# EAGLE design schm1 (EAGLE 7.6.0)
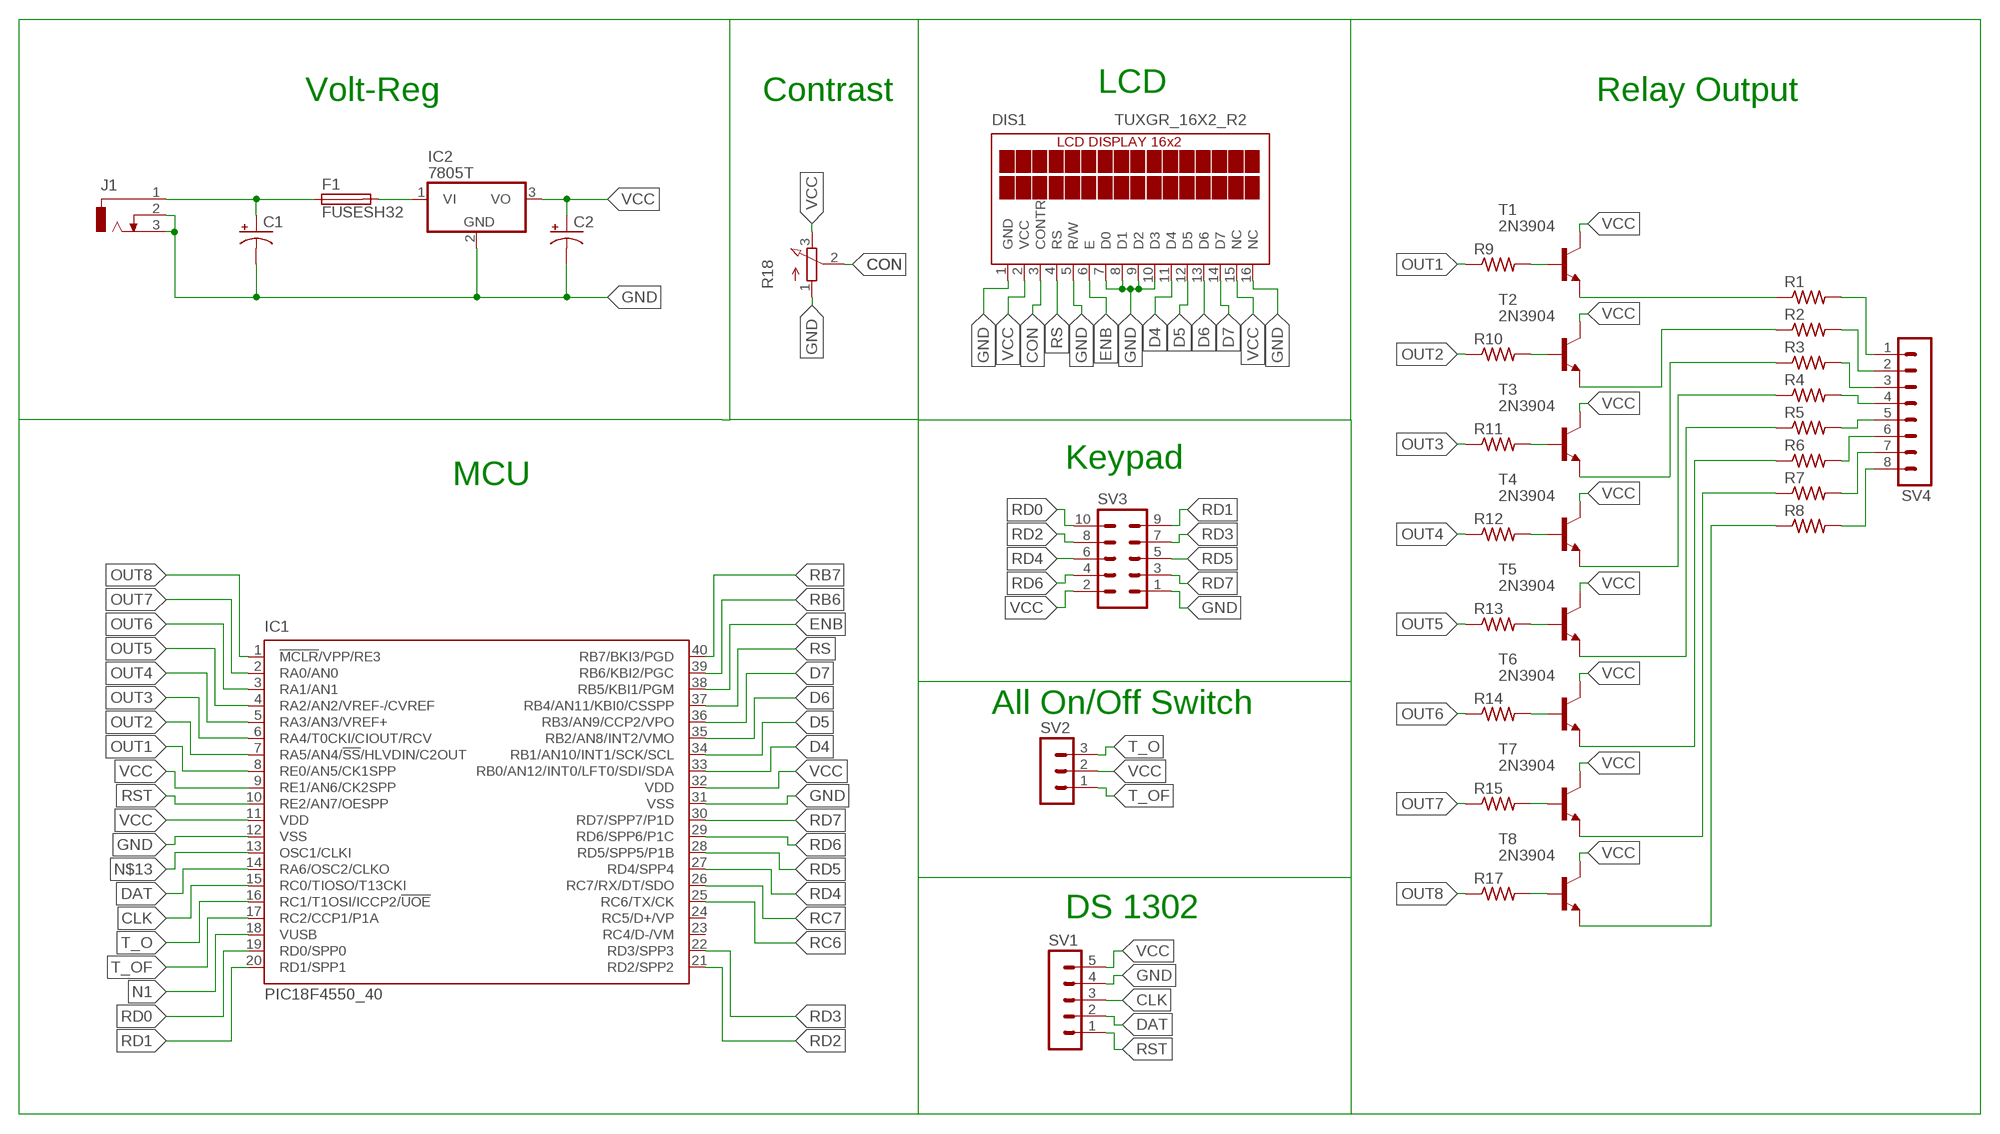
[diagram p0: schematic, sheet 1]

## Parts
C1  CPOL-USE5-10.5  [E5-10,5]
C2  CPOL-USE5-10.5  [E5-10,5]
DIS1  TUXGR_16X2_R2  [TUXGR_16X2_R2]
F1  FUSESH32  [SH32]
IC1  PIC18F4550_40  [DIL40]
IC2  7805T  [TO220H]
J1  DCJ0303  [DCJ0303]
R1  R-US_0207/7  [0207/7]
R2  R-US_0207/7  [0207/7]
R3  R-US_0207/7  [0207/7]
R4  R-US_0207/7  [0207/7]
R5  R-US_0207/7  [0207/7]
R6  R-US_0207/7  [0207/7]
R7  R-US_0207/7  [0207/7]
R8  R-US_0207/7  [0207/7]
R9  R-US_0207/7  [0207/7]
R10  R-US_0207/7  [0207/7]
R11  R-US_0207/7  [0207/7]
R12  R-US_0207/7  [0207/7]
R13  R-US_0207/7  [0207/7]
R14  R-US_0207/7  [0207/7]
R15  R-US_0207/7  [0207/7]
R17  R-US_0207/7  [0207/7]
R18  3RP/1610N  [3RP/1610N]
SV1  MA05-1  [MA05-1]
SV2  MA03-1  [MA03-1]
SV3  MA05-2  [MA05-2]
SV4  MA08-1  [MA08-1]
T1  2N3904  [TO92]
T2  2N3904  [TO92]
T3  2N3904  [TO92]
T4  2N3904  [TO92]
T5  2N3904  [TO92]
T6  2N3904  [TO92]
T7  2N3904  [TO92]
T8  2N3904  [TO92]

## Nets
CLK: IC1.15(RC0/TIOSO/T13CKI) SV1.3
CON: DIS1.3(CONTR) R18.2(S)
D4: DIS1.11(D4) IC1.33(RB0/AN12/INT0/LFT0/SDI/SDA)
D5: DIS1.12(D5) IC1.34(RB1/AN10/INT1/SCK/SCL)
D6: DIS1.13(D6) IC1.35(RB2/AN8/INT2/VMO)
D7: DIS1.14(D7) IC1.36(RB3/AN9/CCP2/VPO)
DAT: IC1.14(RA6/OSC2/CLKO) SV1.2
ENB: DIS1.6(E) IC1.38(RB5/KBI1/PGM)
GND: C1.- C2.- DIS1.1(GND) DIS1.5(R/W) DIS1.7(D0) DIS1.8(D1) DIS1.9(D2) DIS1.10(D3) DIS1.16(NC) IC1.12(VSS) IC1.31(VSS) IC2.2(GND) J1.2 J1.3 R18.1(A) SV1.4 SV3.1
N1: IC1.18(VUSB)
N$11: C1.+ F1.1A J1.1
N$12: F1.2A IC2.1(VI)
N$13: IC1.13(OSC1/CLKI)
N$23: R1.2 SV4.1
N$24: R2.2 SV4.2
N$25: R3.2 SV4.3
N$26: R4.2 SV4.4
N$27: R5.2 SV4.5
N$28: R6.2 SV4.6
N$29: R7.2 SV4.7
N$30: R8.2 SV4.8
N$41: R1.1 T1.3(E)
N$42: R2.1 T2.3(E)
N$43: R3.1 T3.3(E)
N$44: R4.1 T4.3(E)
N$45: R5.1 T5.3(E)
N$46: R6.1 T6.3(E)
N$49: R9.2 T1.2(B)
N$50: R10.2 T2.2(B)
N$51: R11.2 T3.2(B)
N$52: R12.2 T4.2(B)
N$53: R13.2 T5.2(B)
N$54: R14.2 T6.2(B)
N$55: R15.2 T7.2(B)
N$56: R17.2 T8.2(B)
N$57: R7.1 T7.3(E)
N$58: R8.1 T8.3(E)
OUT1: IC1.8(RE0/AN5/CK1SPP) R9.1
OUT2: IC1.7(RA5/AN4/!SS!/HLVDIN/C2OUT) R10.1
OUT3: IC1.6(RA4/T0CKI/CIOUT/RCV) R11.1
OUT4: IC1.5(RA3/AN3/VREF+) R12.1
OUT5: IC1.4(RA2/AN2/VREF-/CVREF) R13.1
OUT6: IC1.3(RA1/AN1) R14.1
OUT7: IC1.2(RA0/AN0) R15.1
OUT8: IC1.1(!MCLR!/VPP/RE3) R17.1
RB6: IC1.39(RB6/KBI2/PGC)
RB7: IC1.40(RB7/BKI3/PGD)
RC6: IC1.25(RC6/TX/CK)
RC7: IC1.26(RC7/RX/DT/SDO)
RD0: IC1.19(RD0/SPP0) SV3.10
RD1: IC1.20(RD1/SPP1) SV3.9
RD2: IC1.21(RD2/SPP2) SV3.8
RD3: IC1.22(RD3/SPP3) SV3.7
RD4: IC1.27(RD4/SPP4) SV3.6
RD5: IC1.28(RD5/SPP5/P1B) SV3.5
RD6: IC1.29(RD6/SPP6/P1C) SV3.4
RD7: IC1.30(RD7/SPP7/P1D) SV3.3
RS: DIS1.4(RS) IC1.37(RB4/AN11/KBI0/CSSPP)
RST: IC1.10(RE2/AN7/OESPP) SV1.1
T_O: IC1.16(RC1/T1OSI/ICCP2/!UOE) SV2.3
T_OF: IC1.17(RC2/CCP1/P1A) SV2.1
VCC: C2.+ DIS1.2(VCC) DIS1.15(NC) IC1.9(RE1/AN6/CK2SPP) IC1.11(VDD) IC1.32(VDD) IC2.3(VO) R18.3(E) SV1.5 SV2.2 SV3.2 T1.1(C) T2.1(C) T3.1(C) T4.1(C) T5.1(C) T6.1(C) T7.1(C) T8.1(C)
Unconnected: IC1.23(RC4/D-/VM) IC1.24(RC5/D+/VP)

## Notes on the sheet
- Volt-Reg | Contrast | LCD | Relay Output
- Keypad
- MCU
- All On/Off Switch
- DS 1302

## Library data of the parts
C1 C2 = rcl:CPOL-US: POLARIZED CAPACITOR, American symbol
DIS1 = display-lcd:TUXGR_16X2_R2: Tuxgraphics LCD display 16x2 characters reflective, without background light Source: tuxgr_12x2_r2.pdf; OC_FARNELL: unknown; OC_NEWARK: unknown
F1 = fuse:FUSE: Fuse; OC_FARNELL: unknown; OC_NEWARK: unknown
IC1 = microchip:PIC18F4*_40: USB Microcontrollers with nanoWatt Technology High-Performance, Enhanced Flash, 28/40/44-Pin, Source: http://ww1.microchip.com/downloads/en/devicedoc/39632c.pdf; MF: MICROCHIP; MPN: PIC18F4550-I/P; OC_FARNELL: 9321357; OC_NEWARK: 74K8623
IC2 = linear:78*: Positive VOLTAGE REGULATOR Source: http://cache.national.com/ds/LM/LM78L05.pdf http://www.fairchildsemi.com/ds/LM/LM7805.pdf
J1 = con-jack:DCJ0303: DC POWER JACK Source: DCJ0303.pdf; OC_FARNELL: unknown; OC_NEWARK: unknown
R1-R15 R17 = rcl:R-US_: RESISTOR, American symbol
R18 = pot:3RP/1610N: 16mm Potentiometer one level Source: http://www.alphapotentiometers.net/html/16mm_pot_2.html
SV1 = con-lstb:MA05-1: PIN HEADER; OC_FARNELL: unknown; OC_NEWARK: unknown
SV2 = con-lstb:MA03-1: PIN HEADER; OC_FARNELL: unknown; OC_NEWARK: unknown
SV3 = con-lstb:MA05-2: PIN HEADER; OC_FARNELL: unknown; OC_NEWARK: unknown
SV4 = con-lstb:MA08-1: PIN HEADER; OC_FARNELL: unknown; OC_NEWARK: unknown
T1-T8 = transistor:2N3904: NPN TRANSISTOR

## Board
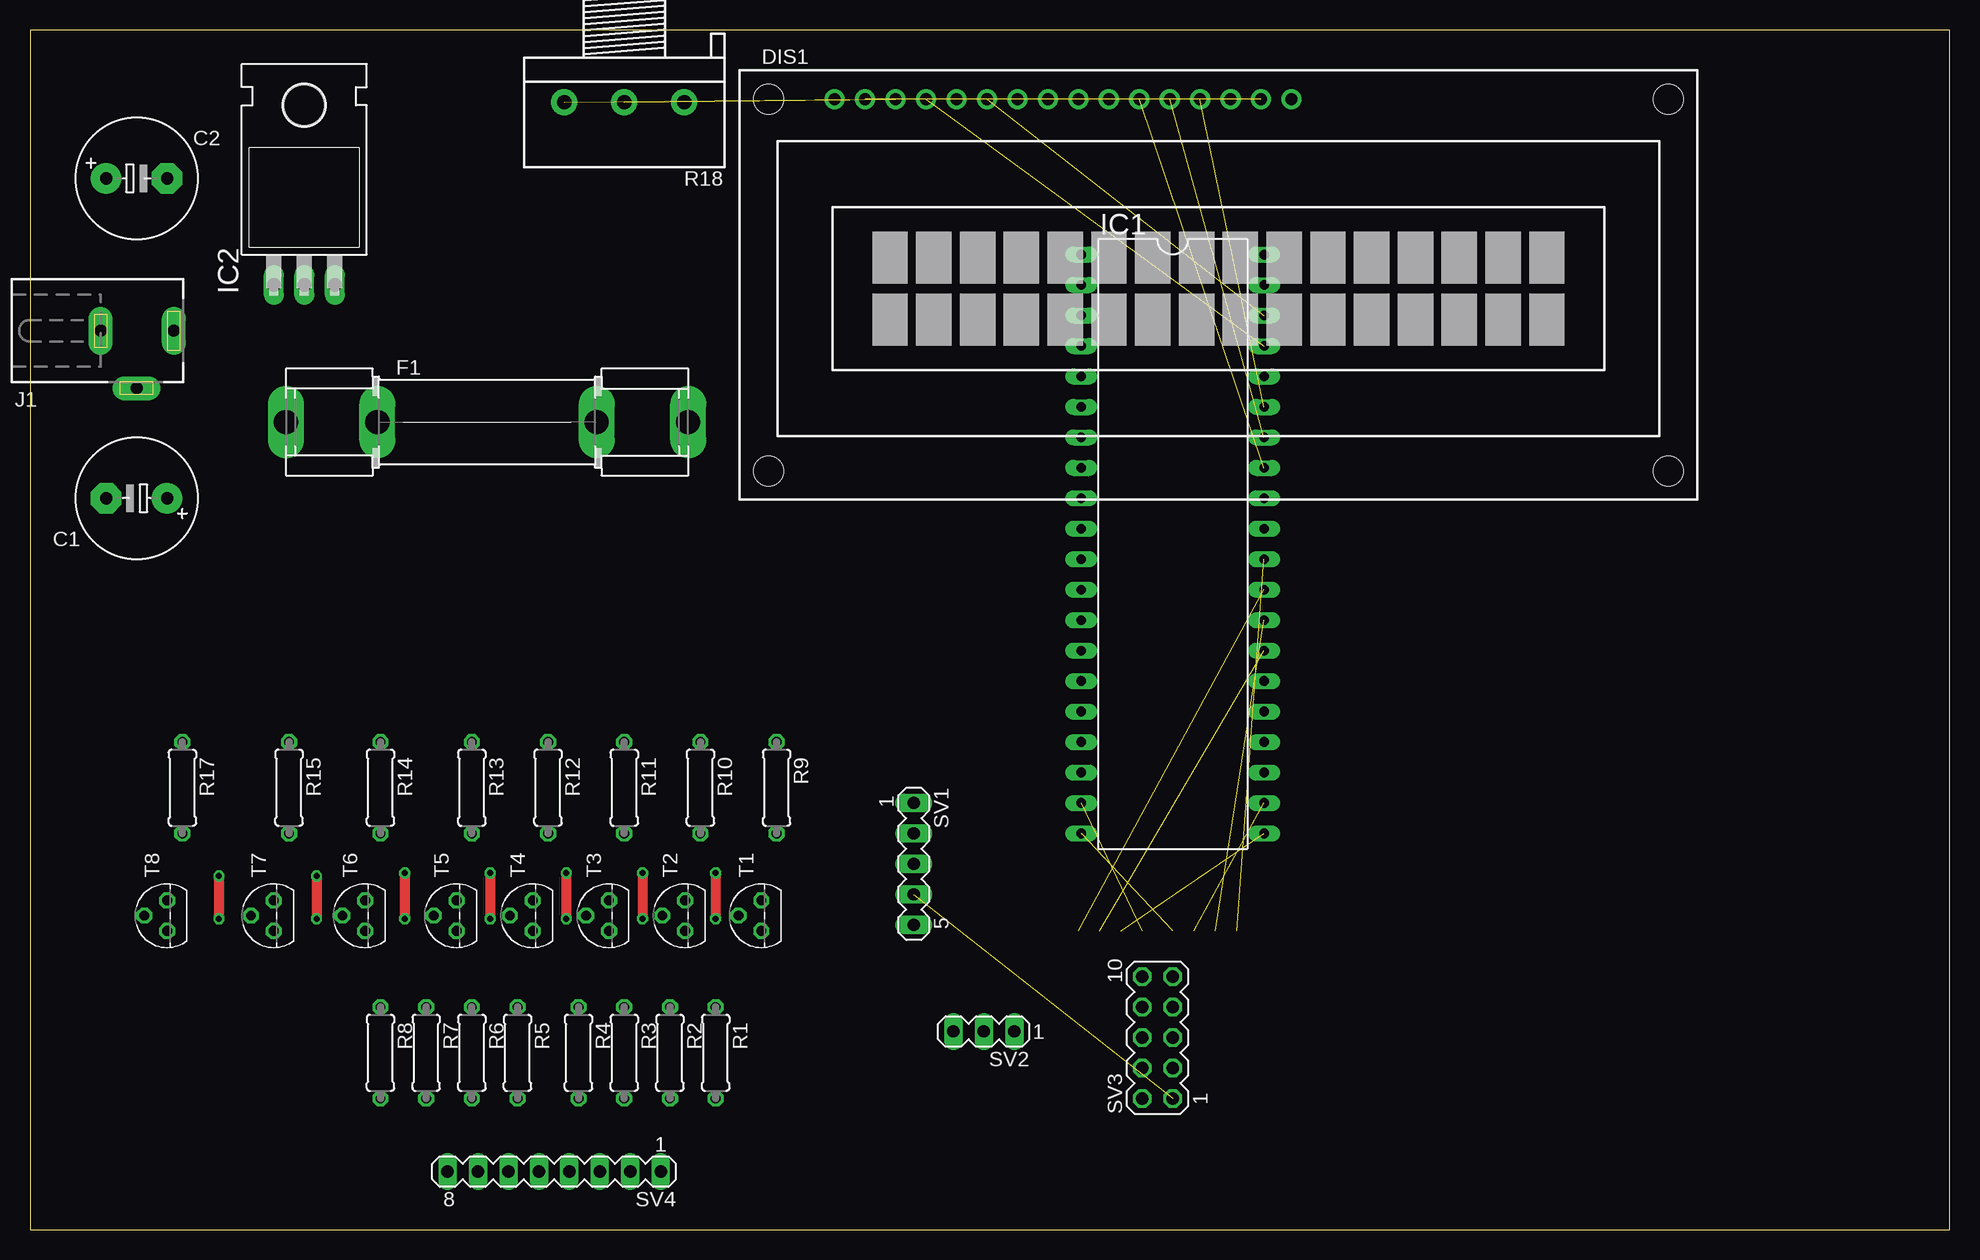
[diagram p1: board, top side]
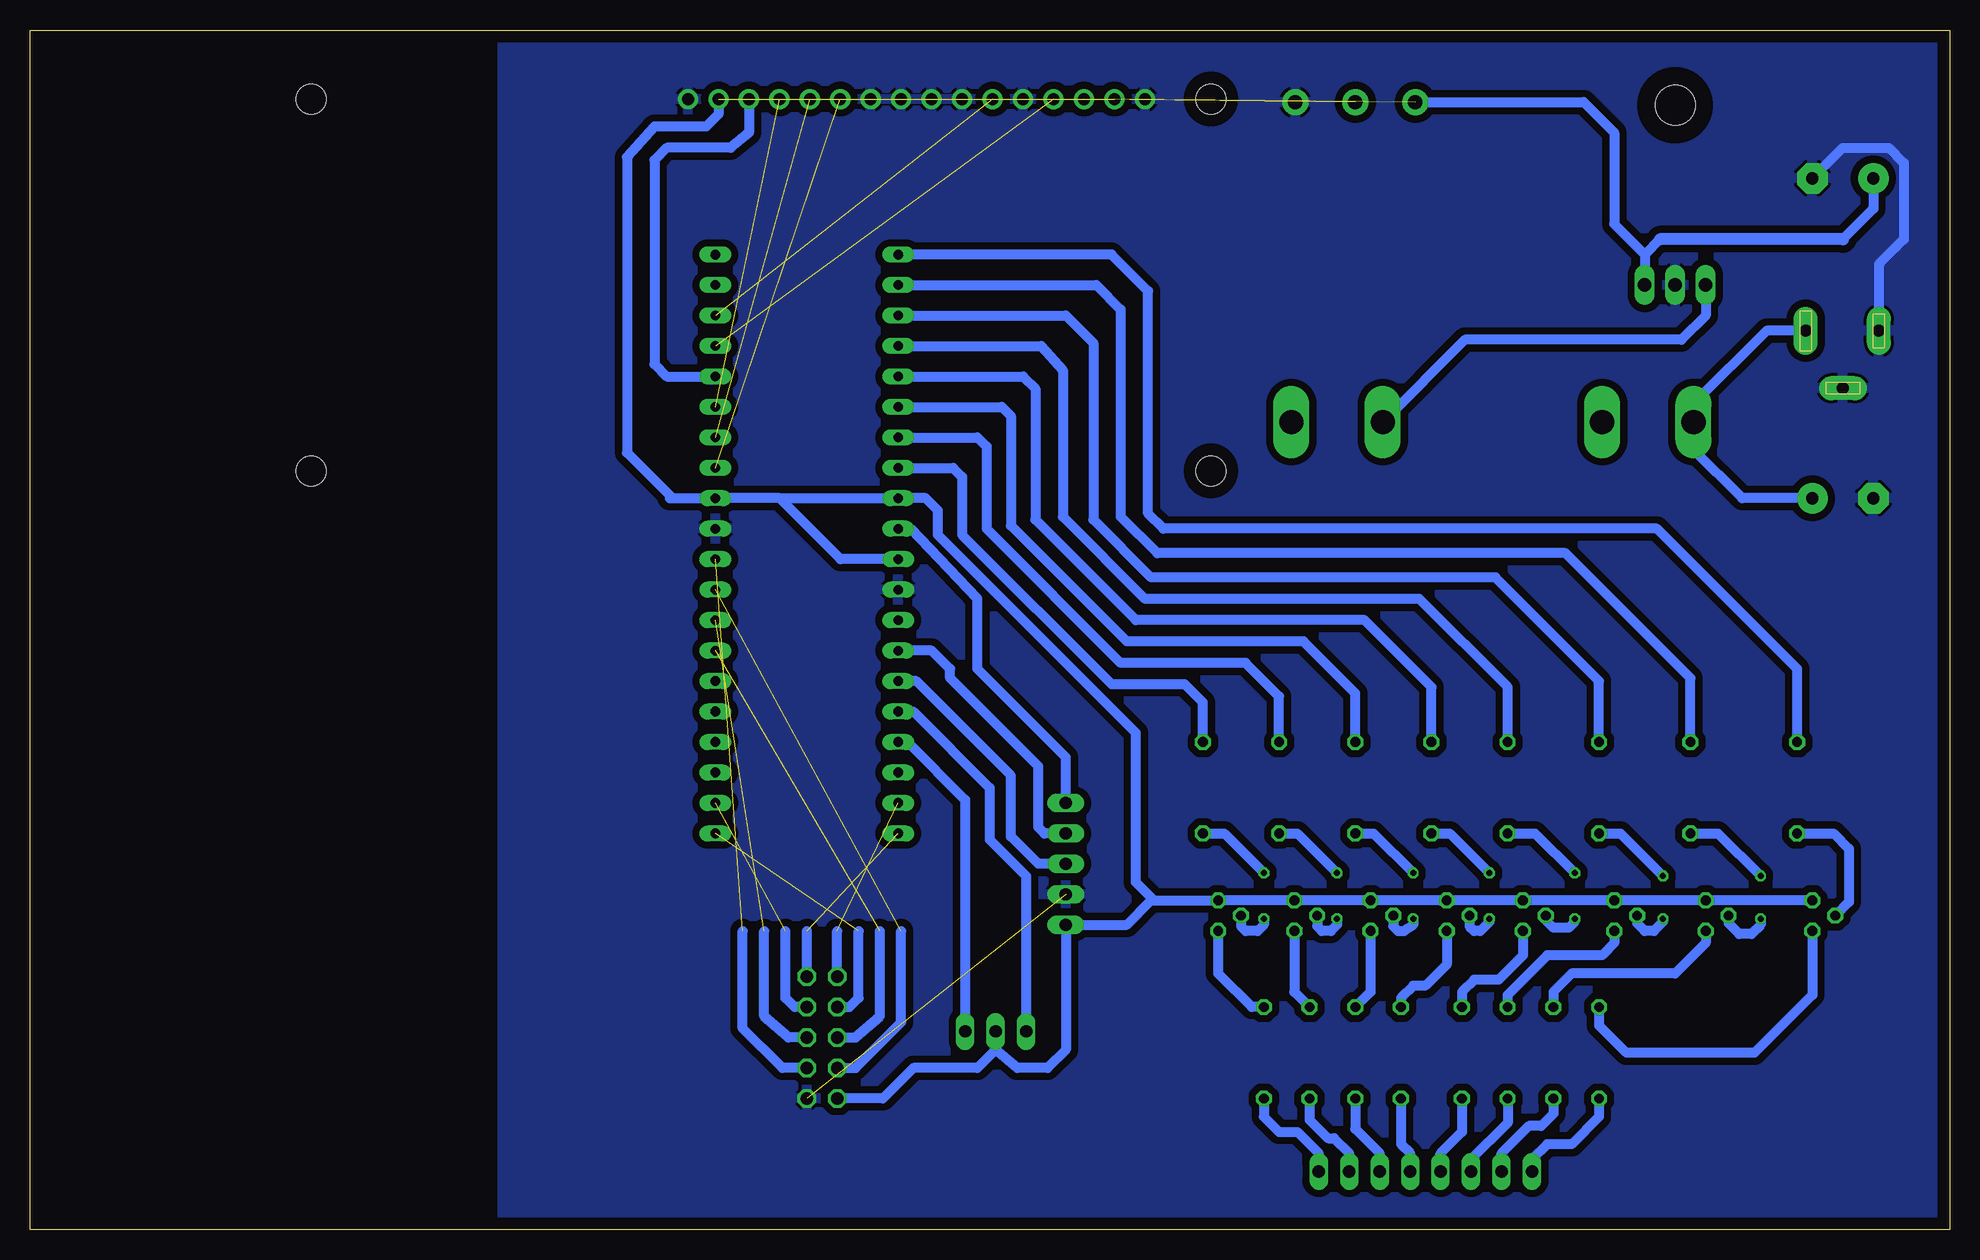
[diagram p2: board, bottom side, seen from below]

Size 160 x 100 mm. Coordinates in mm from the lower left corner, seen from the top.
Outline: 0,0 160,0 160,100 0,100 0,0
Copper layers (1*16): Top 0.035mm / dielectric 1.5mm / Bottom 0.035mm
Design rules "default": minimum track width 10mil, minimum drill 24mil, track to track 8mil, track to pad 8mil, pad to pad 8mil, via to via 8mil, smd to smd 8mil, copper to edge 40mil, drill to drill 8mil, minimum pad ring 10mil, minimum via ring 8mil, stop-mask expansion 4mil, vias tented up to drill 0mil, thermal gap 10mil

### Footprints (pad centres in the part's own frame; a part is rotated, then mirrored left to right if it is on the bottom)
E5-10,5 = drill 1.016 pad 2.54: + -2.54,0 | drill 1.016 pad 2.54 octagon: - 2.54,0
TUXGR_16X2_R2 = drill 1 pad 1.676: 1 -32,15.5; 2 -29.46,15.5; 3 -26.92,15.5; 4 -24.38,15.5; 5 -21.84,15.5; 6 -19.3,15.5; 7 -16.76,15.5; 8 -14.22,15.5; 9 -11.68,15.5; 10 -9.14,15.5; 11 -6.6,15.5; 12 -4.06,15.5; 13 -1.52,15.5; 14 1.02,15.5; 15 3.56,15.5; 16 6.1,15.5 | hole 2.5: -37.5,-15.5; 37.5,-15.5; -37.5,15.5; 37.5,15.5
SH32 = drill 2.007 long: 1A -16.764,0; 1B -9.144,0; 2A 9.144,0; 2B 16.764,0
DIL40 = drill 0.813 long: 1 -24.13,-7.62; 2 -21.59,-7.62; 3 -19.05,-7.62; 4 -16.51,-7.62; 5 -13.97,-7.62; 6 -11.43,-7.62; 7 -8.89,-7.62; 8 -6.35,-7.62; 9 -3.81,-7.62; 10 -1.27,-7.62; 11 1.27,-7.62; 12 3.81,-7.62; 13 6.35,-7.62; 14 8.89,-7.62; 15 11.43,-7.62; 16 13.97,-7.62; 17 16.51,-7.62; 18 19.05,-7.62; 19 21.59,-7.62; 20 24.13,-7.62; 21 24.13,7.62; 22 21.59,7.62; 23 19.05,7.62; 24 16.51,7.62; 25 13.97,7.62; 26 11.43,7.62; 27 8.89,7.62; 28 6.35,7.62; 29 3.81,7.62; 30 1.27,7.62; 31 -1.27,7.62; 32 -3.81,7.62; 33 -6.35,7.62; 34 -8.89,7.62; 35 -11.43,7.62; 36 -13.97,7.62; 37 -16.51,7.62; 38 -19.05,7.62; 39 -21.59,7.62; 40 -24.13,7.62
TO220H = drill 1.118 long: 1 -2.54,-10.16; 2 0,-10.16; 3 2.54,-10.16 | hole 3.302: 0,4.826
DCJ0303 = drill 1 pad 2 long: 1 0,3.1; 2 4.8,0; 3 0,-3
0207/7 = drill 0.813 octagon: 1 -3.81,0; 2 3.81,0
3RP/1610N = drill 1.2 pad 2.184: 1 -5,0; 2 0,0; 3 5,0
MA05-1 = drill 1.016 long: 1 -5.08,0; 2 -2.54,0; 3 0,0; 4 2.54,0; 5 5.08,0
MA03-1 = drill 1.016 long: 1 -2.54,0; 2 0,0; 3 2.54,0
MA05-2 = drill 1.016 octagon: 1 -5.08,-1.27; 2 -5.08,1.27; 3 -2.54,-1.27; 4 -2.54,1.27; 5 0,-1.27; 6 0,1.27; 7 2.54,-1.27; 8 2.54,1.27; 9 5.08,-1.27; 10 5.08,1.27
MA08-1 = drill 1.016 long: 1 -8.89,0; 2 -6.35,0; 3 -3.81,0; 4 -1.27,0; 5 1.27,0; 6 3.81,0; 7 6.35,0; 8 8.89,0
TO92 = drill 0.813 octagon: 1 1.27,0; 2 0,1.905; 3 -1.27,0

### Placement (x,y rotation side)
C1  8.89,60.96 180 top
C2  8.89,87.63 0 top
DIS1  99.06,78.74 0 top
F1  38.1,67.31 0 top
IC1  95.25,57.15 270 top
IC2  22.86,88.9 0 top
J1  8.89,74.93 270 top
R1  57.15,14.73 270 top
R2  53.34,14.73 270 top
R3  49.53,14.73 270 top
R4  45.72,14.73 270 top
R5  40.64,14.73 270 top
R6  36.83,14.73 270 top
R7  33.02,14.73 270 top
R8  29.21,14.73 270 top
R9  62.23,36.83 270 top
R10  55.88,36.83 270 top
R11  49.53,36.83 270 top
R12  43.18,36.83 270 top
R13  36.83,36.83 270 top
R14  29.21,36.83 270 top
R15  21.59,36.83 270 top
R17  12.7,36.83 270 top
R18  49.53,93.98 180 top
SV1  73.66,30.48 270 top
SV2  79.5,16.51 180 top
SV3  93.98,16 90 top
SV4  43.69,4.83 180 top
T1  60.96,26.16 90 top
T2  54.61,26.16 90 top
T3  48.26,26.16 90 top
T4  41.91,26.16 90 top
T5  35.56,26.16 90 top
T6  27.94,26.16 90 top
T7  20.32,26.16 90 top
T8  11.43,26.16 90 top

### Tracks (layer width: path | path; a pad name or v marks a point on that pad's centre or on a via)
CLK
  Bottom 0.813: SV1.3 75.95,30.48 78.23,32.77 78.23,37.85 86.11,45.72 IC1.15
CON  (1 unrouted)
D4  (1 unrouted)
D5  (1 unrouted)
D6  (1 unrouted)
D7
  Bottom 0.813: DIS1.14 100.08,91.44 101.6,90.17 106.93,90.17 107.95,89.15 107.95,72.14 106.93,71.12 103.63,71.12 103.38,70.87 103.12,70.87 IC1.36
DAT
  Bottom 0.813: SV1.2 75.44,33.02 75.95,33.53 75.95,38.61 83.31,45.97 83.31,46.74 84.84,48.26 IC1.14
ENB  (1 unrouted)
GND  (1 unrouted)
  Bottom 0.813: C2.- 8.89,90.17 5.08,90.17 3.81,88.9 3.81,82.55 5.89,80.47 J1.3
  pour Bottom (isolate 0.61): 0,100.33 120.65,100.33 120.65,-1.27 0,-1.27
N$11
  Bottom 0.813: J1.1 15.24,74.93 21.34,68.83 F1.1A 21.34,65.02 17.27,60.96 C1.+
N$12
  Bottom 0.813: IC2.1 20.32,76.2 22.35,74.17 40.39,74.17 F1.2A
N$23
  Bottom 0.813: SV4.1 52.58,6.35 54.36,8.13 55.88,8.13 57.15,9.4 R1.2
N$24
  Bottom 0.813: SV4.2 50.04,6.35 51.31,7.62 51.82,7.62 53.34,9.14 R2.2
N$25
  Bottom 0.813: SV4.3 47.5,6.35 49.53,8.38 R3.2
N$26
  Bottom 0.813: SV4.4 44.96,6.35 45.72,7.11 R4.2
N$27
  Bottom 0.813: R5.2 40.64,8.13 42.42,6.35 SV4.5
N$28
  Bottom 0.813: SV4.6 39.88,5.84 36.83,8.89 R6.2
N$29
  Bottom 0.813: R7.2 33.02,9.65 34.04,8.64 35.05,8.64 37.34,6.35 SV4.7
N$30
  Bottom 0.813: R8.2 29.21,9.4 31.5,7.11 33.53,7.11 34.8,5.84 SV4.8
N$41
  Bottom 0.813: T1.3 60.96,21.34 58.17,18.54 R1.1
N$42
  Bottom 0.813: T2.3 54.61,19.81 R2.1
N$43
  Bottom 0.813: T3.3 48.26,19.81 R3.1
N$44
  Bottom 0.813: T4.3 41.91,22.1 43.69,20.32 44.7,20.32 45.72,19.3 R4.1
N$45
  Bottom 0.813: T5.3 35.56,22.86 37.59,20.83 39.62,20.83 40.64,19.81 R5.1
N$46
  Bottom 0.813: T6.3 27.94,23.88 28.96,22.86 33.53,22.86 36.83,19.56 R6.1
N$49  (via drill 0.5 pad 0.81)
  Top 0.813: v57.15,29.72 v57.15,25.91
  Bottom 0.813: R9.2 60.45,33.02 v57.15,29.72 | v57.15,25.91 57.15,25.4 57.66,24.89 58.67,24.89 59.05,25.27 T1.2
N$50  (via drill 0.5 pad 0.81)
  Top 0.813: v51.05,29.72 v51.05,25.91
  Bottom 0.813: R10.2 54.36,33.02 v51.05,29.72 | v51.05,25.91 51.05,25.4 51.56,24.89 52.32,24.89 52.7,25.27 T2.2
N$51  (via drill 0.5 pad 0.81)
  Top 0.813: v44.7,29.72 v44.7,25.91
  Bottom 0.813: R11.2 48.01,33.02 v44.7,29.72 | v44.7,25.91 44.7,25.4 45.47,24.89 45.97,24.89 46.35,25.27 T3.2
N$52  (via drill 0.5 pad 0.81)
  Top 0.813: v38.35,29.72 v38.35,25.91
  Bottom 0.813: R12.2 41.66,33.02 v38.35,29.72 | v38.35,25.91 38.35,25.65 39.12,24.89 39.62,24.89 40.01,25.27 T4.2
N$53  (via drill 0.5 pad 0.81)
  Top 0.813: v31.24,29.72 v31.24,25.91
  Bottom 0.813: R13.2 34.54,33.02 v31.24,29.72 | v31.24,25.91 31.24,25.65 31.75,25.15 33.02,25.15 33.66,25.78 T5.2
N$54  (via drill 0.5 pad 0.81)
  Top 0.813: v23.88,29.46 v23.88,25.91
  Bottom 0.813: R14.2 27.43,33.02 v23.88,29.46 | v23.88,25.91 23.88,25.65 24.64,24.89 25.4,24.89 26.04,25.53 T6.2
N$55  (via drill 0.5 pad 0.81)
  Top 0.813: v15.75,29.46 v15.75,25.91
  Bottom 0.813: R15.2 19.3,33.02 v15.75,29.46 | v15.75,25.91 15.75,25.4 16.51,24.64 17.53,24.64 18.41,25.53 T7.2
N$56
  Bottom 0.813: R17.2 9.65,33.02 8.38,31.75 8.38,27.3 T8.2
N$57
  Bottom 0.813: T7.3 20.32,23.88 22.86,21.34 31.5,21.34 33.02,19.81 R7.1
N$58
  Bottom 0.813: T8.3 11.43,19.56 16.26,14.73 26.92,14.73 29.21,17.02 R8.1
OUT1
  Bottom 0.813: R9.1 62.23,43.94 63.75,45.47 69.85,45.47 82.3,57.91 82.3,62.74 83.06,63.5 IC1.8
OUT2
  Bottom 0.813: R10.1 55.88,44.45 58.67,47.24 69.09,47.24 80.26,58.42 80.26,65.28 81.03,66.04 IC1.7
OUT3
  Bottom 0.813: R11.1 49.53,44.7 53.85,49.02 68.58,49.02 78.23,58.67 78.23,67.82 78.99,68.58 IC1.6
OUT4
  Bottom 0.813: R12.1 43.18,45.21 48.77,50.8 67.82,50.8 76.2,59.18 76.2,70.1 77.22,71.12 IC1.5
OUT5
  Bottom 0.813: R13.1 36.83,45.21 44.2,52.58 67.06,52.58 73.91,59.44 73.91,71.63 75.69,73.66 IC1.4
OUT6
  Bottom 0.813: R14.1 29.21,45.72 37.85,54.36 66.55,54.36 71.37,59.18 71.37,73.91 73.66,76.2 IC1.3
OUT7
  Bottom 0.813: R15.1 21.59,45.97 32,56.39 66.04,56.39 69.09,59.44 69.09,76.71 71.12,78.74 IC1.2
OUT8
  Bottom 0.813: R17.1 12.7,46.74 24.38,58.42 65.53,58.42 66.8,59.69 66.8,78.23 69.85,81.28 IC1.1
RD0  (1 unrouted)
  Bottom 0.813: SV3.10 92.71,24.89
RD1  (1 unrouted)
  Bottom 0.813: SV3.9 95.25,24.89
RD2  (1 unrouted)
  Bottom 0.813: SV3.8 91.69,18.54 90.93,19.3 90.93,24.89
RD3  (1 unrouted)
  Bottom 0.813: SV3.7 96.27,18.54 97.03,19.3 97.03,24.89
RD4  (1 unrouted)
  Bottom 0.813: SV3.6 91.19,16 89.15,17.78 89.15,24.89
RD5  (1 unrouted)
  Bottom 0.813: SV3.5 96.77,16 98.81,17.78 98.81,24.89
RD6  (1 unrouted)
  Bottom 0.813: SV3.4 91.19,13.46 87.38,17.27 87.38,24.89
RD7  (1 unrouted)
  Bottom 0.813: SV3.3 97.28,13.46 100.58,16.76 100.58,24.89
RS  (1 unrouted)
RST
  Bottom 0.813: SV1.1 73.66,39.37 81.03,46.74 81.03,52.58 86.61,58.42 IC1.10
T_O
  Bottom 0.813: IC1.16 86.36,43.18 80.01,36.83 80.01,32.51 76.96,29.46 SV2.3
T_OF
  Bottom 0.813: IC1.17 86.87,40.64 82.04,35.81 SV2.1
VCC  (2 unrouted)
  Bottom 0.813: C2.+ 6.35,85.09 8.89,82.55 | 24.13,82.55 25.4,81.28 | 25.4,81.28 IC2.3 | R18.3 30.48,93.98 27.94,91.44 27.94,83.82 25.4,81.28 | T8.1 T7.1 T6.1 T5.1 T4.1 | 42.42,27.43 T4.1 | T4.1 T3.1 T2.1 T1.1 66.55,27.43 | DIS1.15 102.62,92.97 103.63,91.95 107.95,91.95 110.24,89.41 110.24,64.77 106.43,60.96 | 106.43,60.96 IC1.32 97.54,60.96 | DIS1.2 | 106.68,60.96 106.43,60.96 | 79.5,14.99 77.72,13.46 75.18,13.46 73.66,14.99 SV1.5 68.58,25.4 66.55,27.43 | SV2.2 79.5,14.99 | 79.5,14.99 81.03,13.46 86.36,13.46 88.9,10.92 SV3.2 | 66.55,27.43 66.55,27.69 67.82,28.96 67.82,41.4 84.33,57.91 84.33,59.94 85.34,60.96 IC1.9 97.54,60.96 | IC1.11 92.46,55.88 97.54,60.96
  Bottom 1.016: 8.89,82.55 24.13,82.55